# Altium schematic sheet imx6_ctrl_i2c1.SchDoc
size A3; SheetNumber: 2; SheetTotal: 21
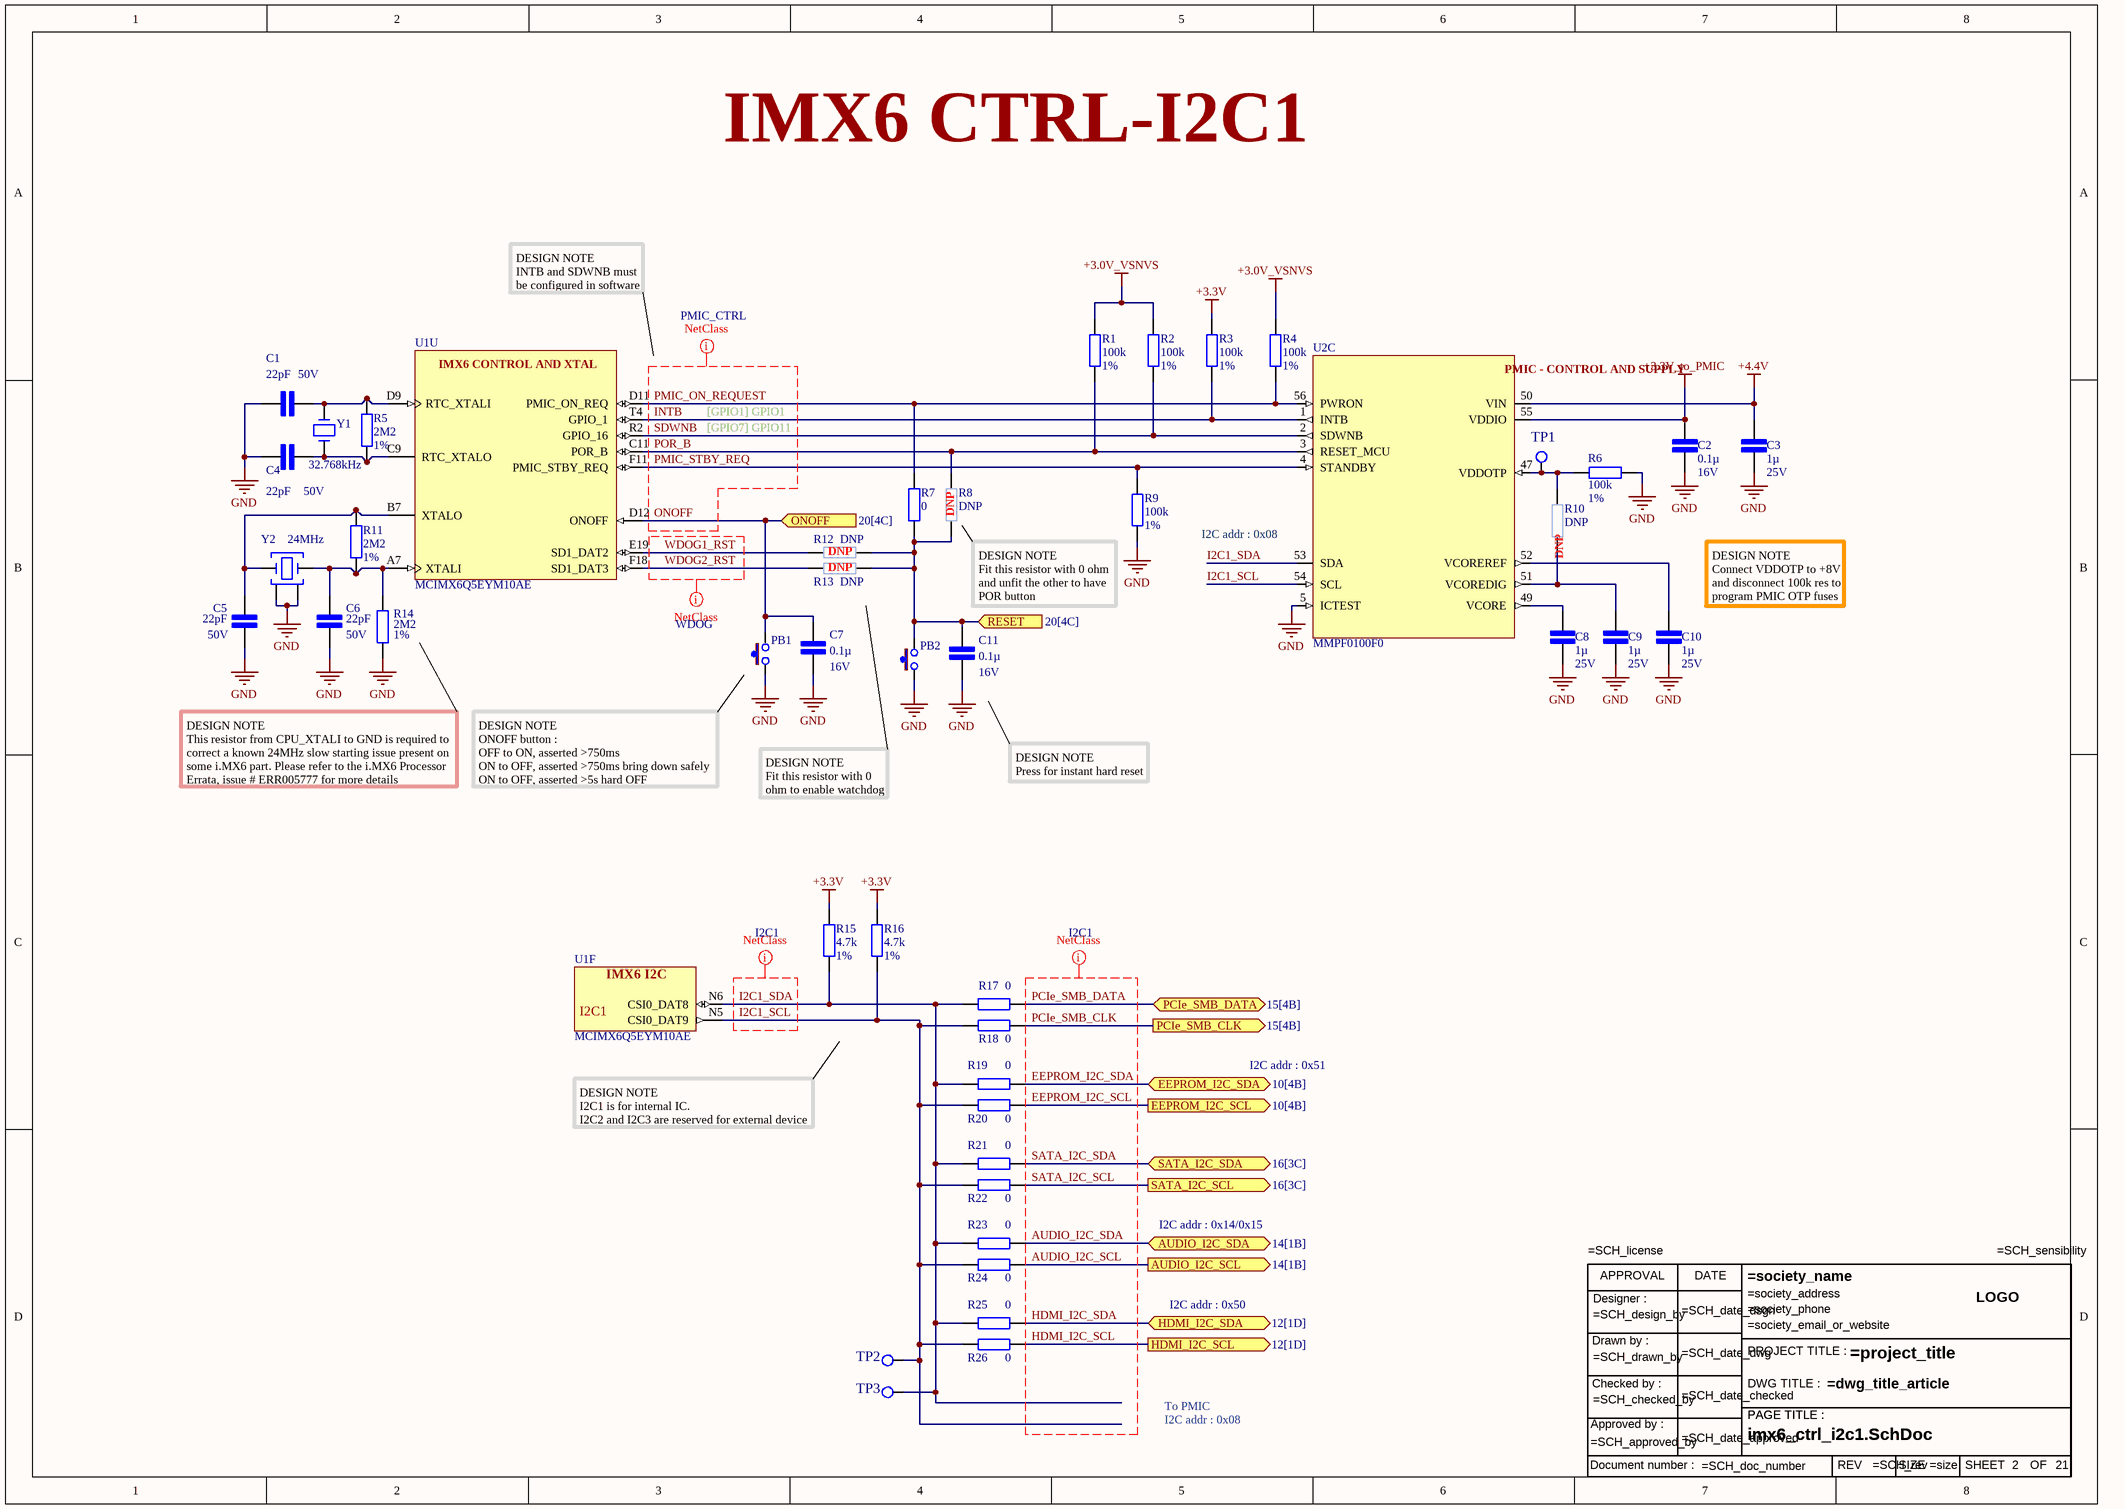
[diagram p0: imx6_ctrl_i2c1.SchDoc]

## Parts
C1  22pF  Tension du diélectrique: 50V  [Cap cer 0402/1005]
C2  0.1µ  Tension du diélectrique: 16V  [Cap cer 0402/1005]
C3  1µ  Tension du diélectrique: 25V  [Cap cer 0402/1005]
C4  22pF  Tension du diélectrique: 50V  [Cap cer 0402/1005]
C5  22pF  Tension du diélectrique: 50V  [Cap cer 0402/1005]
C6  22pF  Tension du diélectrique: 50V  [Cap cer 0402/1005]
C7  0.1µ  Tension du diélectrique: 16V  [Cap cer 0402/1005]
C8  1µ  Tension du diélectrique: 25V  [Cap cer 0402/1005]
C9  1µ  Tension du diélectrique: 25V  [Cap cer 0402/1005]
C10  1µ  Tension du diélectrique: 25V  [Cap cer 0402/1005]
C11  0.1µ  Tension du diélectrique: 16V  [Cap cer 0402/1005]
PB1  pb_434121025816  [pb_434121025816]  (value not drawn)
PB2  pb_434121025816  [pb_434121025816]  (value not drawn)
R1  100k  pourcentage: 1%  [Res 0402/1005]
R2  100k  pourcentage: 1%  [Res 0402/1005]
R3  100k  pourcentage: 1%  [Res 0402/1005]
R4  100k  pourcentage: 1%  [Res 0402/1005]
R5  2M2  pourcentage: 1%  [Res 0402/1005]
R6  100k  pourcentage: 1%  [Res 0402/1005]
R7  0  [Res 0603/1603]
R8  DNP  [Res 0603/1603]
R9  100k  pourcentage: 1%  [Res 0402/1005]
R10  DNP  [Res 0402/1005]
R11  2M2  pourcentage: 1%  [Res 0402/1005]
R12  DNP  [Res 0603/1603]
R13  DNP  [Res 0603/1603]
R14  2M2  pourcentage: 1%  [Res 0402/1005]
R15  4.7k  pourcentage: 1%  [Res 0402/1005]
R16  4.7k  pourcentage: 1%  [Res 0402/1005]
R17  0  [Res 0603/1603]
R18  0  [Res 0603/1603]
R19  0  [Res 0603/1603]
R20  0  [Res 0603/1603]
R21  0  [Res 0603/1603]
R22  0  [Res 0603/1603]
R23  0  [Res 0603/1603]
R24  0  [Res 0603/1603]
R25  0  [Res 0603/1603]
R26  0  [Res 0603/1603]
TB3  Title bloc ANSI modified  (value not drawn)
TP1  Test Point  [testpoint 1mm]  (value not drawn)
TP2  Test Point  [testpoint 1mm]  (value not drawn)
TP3  Test Point  [testpoint 1mm]  (value not drawn)
U1  MCIMX6Q5EYM10AE  [FRES-2197-01]  (parts F,U of 21)
U2  MMPF0100F0  [MMPF0100]  (part C of 3)
Y1  32.768kHz  [IQXC-25]
Y2  24MHz  [IQXC-42]

## Ports
AUDIO_I2C_SCL (out, see 14[1B]), AUDIO_I2C_SDA (bidir, see 14[1B]), EEPROM_I2C_SCL (out, see 10[4B]), EEPROM_I2C_SDA (bidir, see 10[4B]), HDMI_I2C_SCL (out, see 12[1D]), HDMI_I2C_SDA (bidir, see 12[1D]), ONOFF (in, see 20[4C]), PCIe_SMB_CLK (out, see 15[4B]), PCIe_SMB_DATA (bidir, see 15[4B]), RESET (in, see 20[4C]), SATA_I2C_SCL (out, see 16[3C]), SATA_I2C_SDA (bidir, see 16[3C])

## Nets
+3.0V_VSNVS: R1.2 R2.2 R4.2
+3.3V: R3.2 R15.2 R16.2
+3.3V_to_PMIC: C2.1 U2.55(VDDIO)
+4.4V: C3.1 U2.50(VIN)
GND: C1.2 C2.2 C3.2 C4.2 C5.2 C6.2 C7.2 C8.2 C9.2 C10.2 C11.2 PB1.1 PB2.1 R6.1 R9.1 R14.1 U2.5(ICTEST) Y2.2(GND) Y2.4(GND)
AUDIO_I2C_SCL: R24.2 ; port AUDIO_I2C_SCL
AUDIO_I2C_SDA: R23.2 ; port AUDIO_I2C_SDA
EEPROM_I2C_SCL: R20.2 ; port EEPROM_I2C_SCL
EEPROM_I2C_SDA: R19.2 ; port EEPROM_I2C_SDA
HDMI_I2C_SCL: R26.2 ; port HDMI_I2C_SCL
HDMI_I2C_SDA: R25.2 ; port HDMI_I2C_SDA
I2C1_SCL: R16.1 R18.1 R20.1 R22.1 R24.1 R26.1 TP2.1(tp) U1.N5(CSI0_DAT9) U2.54(SCL)
I2C1_SDA: R15.1 R17.1 R19.1 R21.1 R23.1 R25.1 TP3.1(tp) U1.N6(CSI0_DAT8) U2.53(SDA)
INTB: R3.1 U1.T4(GPIO_1) U2.1(INTB)
ONOFF: C7.1 PB1.2 U1.D12(ONOFF) ; port ONOFF
PCIe_SMB_CLK: R18.2 ; port PCIe_SMB_CLK
PCIe_SMB_DATA: R17.2 ; port PCIe_SMB_DATA
PMIC_ON_REQUEST: R4.1 R7.2 U1.D11(PMIC_ON_REQ) U2.56(PWRON)
PMIC_STBY_REQ: R9.2 U1.F11(PMIC_STBY_REQ) U2.4(STANDBY)
POR_B: R1.1 R8.2 U1.C11(POR_B) U2.3(RESET_MCU)
RESET: C11.1 PB2.2 R7.1 R8.1 R12.2 R13.2 ; port RESET
SATA_I2C_SCL: R22.2 ; port SATA_I2C_SCL
SATA_I2C_SDA: R21.2 ; port SATA_I2C_SDA
SDWNB: R2.1 U1.R2(GPIO_16) U2.2(SDWNB)
WDOG1_RST: R12.1 U1.E19(SD1_DAT2)
WDOG2_RST: R13.1 U1.F18(SD1_DAT3)
NetC1_1: C1.1 R5.2 U1.D9(RTC_XTALI) Y1.2(Crystal)
NetC4_1: C4.1 R5.1 U1.C9(RTC_XTALO) Y1.1(Crystal)
NetC5_1: C5.1 R11.2 U1.B7(XTALO) Y2.1(Crystal)
NetC6_1: C6.1 R11.1 R14.2 U1.A7(XTALI) Y2.3(Crystal)
NetC8_1: C8.1 U2.49(VCORE)
NetC9_1: C9.1 R10.1 U2.51(VCOREDIG)
NetC10_1: C10.1 U2.52(VCOREREF)
NetR6_2: R6.2 R10.2 TP1.1(tp) U2.47(VDDOTP)

## Layout directives
net class I2C1: AUDIO_I2C_SCL, AUDIO_I2C_SDA, EEPROM_I2C_SCL, EEPROM_I2C_SDA, HDMI_I2C_SCL, HDMI_I2C_SDA, I2C1_SCL, I2C1_SDA, PCIe_SMB_CLK, PCIe_SMB_DATA, SATA_I2C_SCL, SATA_I2C_SDA
net class PMIC_CTRL: INTB, ONOFF, PMIC_ON_REQUEST, PMIC_STBY_REQ, POR_B, SDWNB
net class WDOG: WDOG1_RST, WDOG2_RST

## Notes on the sheet
- IMX6 CTRL-I2C1
- DESIGN NOTE
  INTB and SDWNB must be configured in software
- [GPIO1] GPIO1
- [GPIO7] GPIO11
- (near U2) I2C addr : 0x08
- DESIGN NOTE
  Fit this resistor with 0 ohm and unfit the other to have POR button
- (near C10) DESIGN NOTE
  Connect VDDOTP to +8V and disconnect 100k res to program PMIC OTP fuses
- DESIGN NOTE
  This resistor from CPU_XTALI to GND is required to
  correct a known 24MHz slow starting issue present on
  some i.MX6 part. Please refer to the i.MX6 Processor
  Errata, issue # ERR005777 for more details
- DESIGN NOTE
  ONOFF button :
  OFF to ON, asserted >750ms
  ON to OFF, asserted >750ms bring down safely
  ON to OFF, asserted >5s hard OFF
- DESIGN NOTE
  Press for instant hard reset
- DESIGN NOTE
  Fit this resistor with 0 ohm to enable watchdog
- DESIGN NOTE
  I2C1 is for internal IC.
  I2C2 and I2C3 are reserved for external device
- I2C addr : 0x51
- I2C addr : 0x14/0x15
- I2C addr : 0x50
- To PMIC
  I2C addr : 0x08
- (in symbol IC MMPF0100, part C) PMIC - CONTROL AND SUPPLY
- (in symbol IMX6Q5EYM10AE, part F) IMX6 I2C; I2C1
- (in symbol IMX6Q5EYM10AE, part U) IMX6 CONTROL AND XTAL
- (in symbol Title bloc ANSI) APPROVAL; DATE; Designer :; LOGO; Drawn by :; PROJECT TITLE :; Checked by :; DWG TITLE :; PAGE TITLE :; Approved by :; Document number :; REV; SIZE; SHEET; OF

## Library data of the parts
C1 C4-C6 = cap 22pF 50V: cap cer 22pF 50V 5% NP0 0402; Diélectrique: NP0
C2 C7 C11 = cap 0.1µ 16V: cap solid electrolyte 0.1µ 6.3V 10%; Diélectrique: X7R
C3 C8-C10 = cap 1µ 25V: cap cer 1µ 25V 10% X5R 0402; Diélectrique: X5R
R1-R4 R6 R9 = res 100k 1%: res 100k 1% 0402
R5 R11 R14 = res 2M2 1%: res 2M2 1% 0402
R7 R17-R26 = res 0Ohm: res 0603; pourcentage: --
R8 R12 R13 = res DNP 0603: pourcentage: 1%
R10 = res DNP: res DNP 0402; pourcentage: 1%
R15 R16 = res 4.7k 1%: res 4.7k 1% 0402
TB3 = Title bloc ANSI
TP1-TP3 = Test Point: Test point 1mm diameter
U1 = IMX6Q5EYM10AE: 32-Bit i.MX 6 Quad Application Processor, 1 GHz, 256 KB RAM, Extended Consumer Grade, 624-Pin FCPBGA, RoHS, Tape and Reel; PartNumber: MCIMX6Q5EYM10ACR; Manufacturer: Freescale Semiconductor; CAN: FlexCAN; Number of Cores: 4 Spec; External Memory Supported: DDR3, DDR3L, FLASH, LPDDR2; Speed Grade: 1 GHz; Core Type: ARM Cortex A9; Cache (KB): 32; Ethernet: 1 Gbps + IEEE 1588; Internal RAM (KB): 256; ComponentLink1Description: Manufacturer URL; ComponentLink2Description: Datasheet; DatasheetVersion: Rev. 2.3; ComponentLink3URL: http://cache.freescale.com/files/32bit/doc/data_sheet/IMX6DQCEC.pdf?fpsp=1&WT_TYPE=Data%20Sheets&WT_VENDOR=FREESCALE&WT_FILE_FORMAT=pdf&WT_ASSET=Documentation; ComponentLink1URL: http://www.freescale.com/; Packing: Tape and Reel; Temperature Range: -20 to 105 degC; ComponentLink2URL: http://cache.freescale.com/files/32bit/doc/data_sheet/IMX6DQCEC.pdf?fpsp=1&WT_TYPE=Data%20Sheets&WT_VENDOR=FREESCALE&WT_FILE_FORMAT=pdf&WT_ASSET=Documentation; ComponentLink3Description: Package Specification; PackageVersion: Rev. A; RoHS: TRUE; Quad/Dual CPU: i.MX 6Quad; Mounting Technology: Surface Mount; PackageReference: FCPBGA-624; PackageDescription: 624-pin Ball Grid Array Package, Body 21 x 21mm, Pitch 0.8mm
U2 = IC MMPF0100: PMIC; ComponentLink1Description: New link; ComponentLink1URL: D:\Carte_IMX6\datasheet\MMPF0100.pdf
Y1 = XTAL 32.768kHz: WE-XTAL, 25MHz, +/-10ppm 830062558
Y2 = XTAL 24MHz: WE-XTAL 24MHz, +/-10ppm / 830108212309; Manufacturer: Wurth Elektronik; Load Capacitance: 10pF; ComponentLink2Description: Datasheet; ComponentLink2URL: https://www.we-online.com/catalog/datasheet/830108212309.pdf; Operating Temperature: -20 to +70degC; Packaging: Tape and Reel; Manufacturer Part Number: 830108212309; Published Date: July 2020; Frequency Stability: +/-10ppm; Frequency: 24MHz; Frequency Tolerance: +/-10ppm; Mounting Technology: SMT